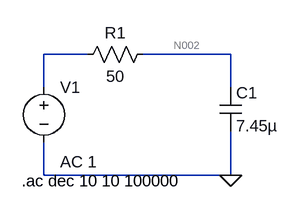
[diagram p0: schematic Task3ai.asc]
Task3ai.asc, the LTspice schematic file:
Version 4
SHEET 1 880 680
WIRE 208 80 144 80
WIRE 416 80 288 80
WIRE 144 128 144 80
WIRE 416 128 416 80
WIRE 144 256 144 208
WIRE 416 256 416 192
WIRE 416 256 144 256
FLAG 416 256 0
SYMBOL voltage 144 112 R0
WINDOW 123 24 124 Left 2
WINDOW 39 0 0 Left 0
SYMATTR Value2 AC 1
SYMATTR InstName V1
SYMATTR Value ""
SYMBOL res 192 96 R270
WINDOW 0 32 56 VTop 2
WINDOW 3 0 56 VBottom 2
SYMATTR InstName R1
SYMATTR Value 50
SYMBOL cap 400 128 R0
SYMATTR InstName C1
SYMATTR Value 7.45µ
TEXT 112 264 Left 2 !.ac dec 10 10 100000

The netlist it stands for:
* Task3ai.asc
V1 N001 0 AC 1
R1 N001 N002 50
C1 N002 0 7.45µ
.ac dec 10 10 100000
.backanno
.end

* Results of the author's LTspice run, read from the files saved beside the schematic
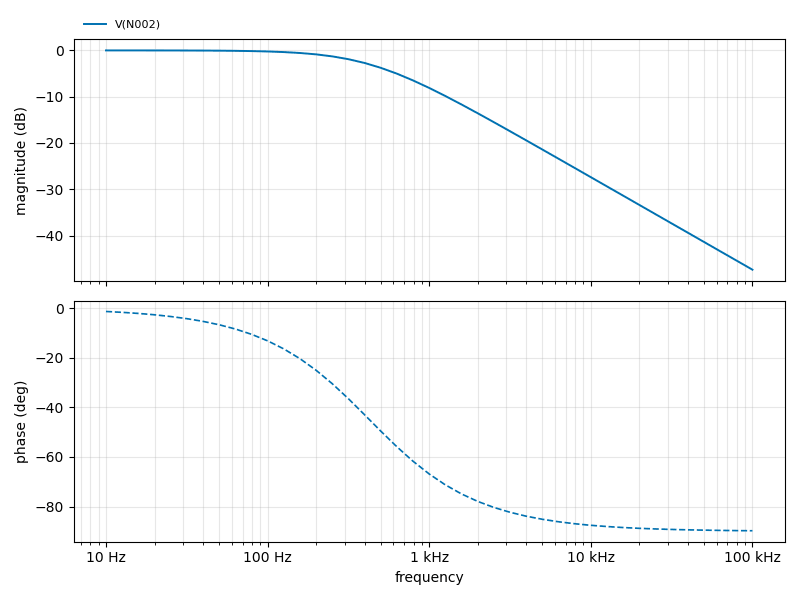
[diagram p1: AC Analysis of Task3ai.asc, plotted from the saved traces]
* AC Analysis, 1 run:
*   V(N002): -0.00 dB at 10 Hz, -47.39 dB at 100 kHz, peak -0.00 dB at 10 Hz, 3 dB below the peak at 425.2 Hz